# Altium schematic sheet interface.SchDoc: USB Interface (part 1 of 3)
size A4; Author: Peilin Perry Xu; CompanyName: N/A; DrawnBy: Peilin Perry Xu; Engineer: Peilin Perry Xu; Organization: N/A; Address1: 89 Chestnut Street, Toronto, ON, Canada; Address2: 79 Brass Drive, Richmond Hill, ON, Canada; DocumentNumber: 3; Revision: 2; SheetNumber: 6; SheetTotal: 11
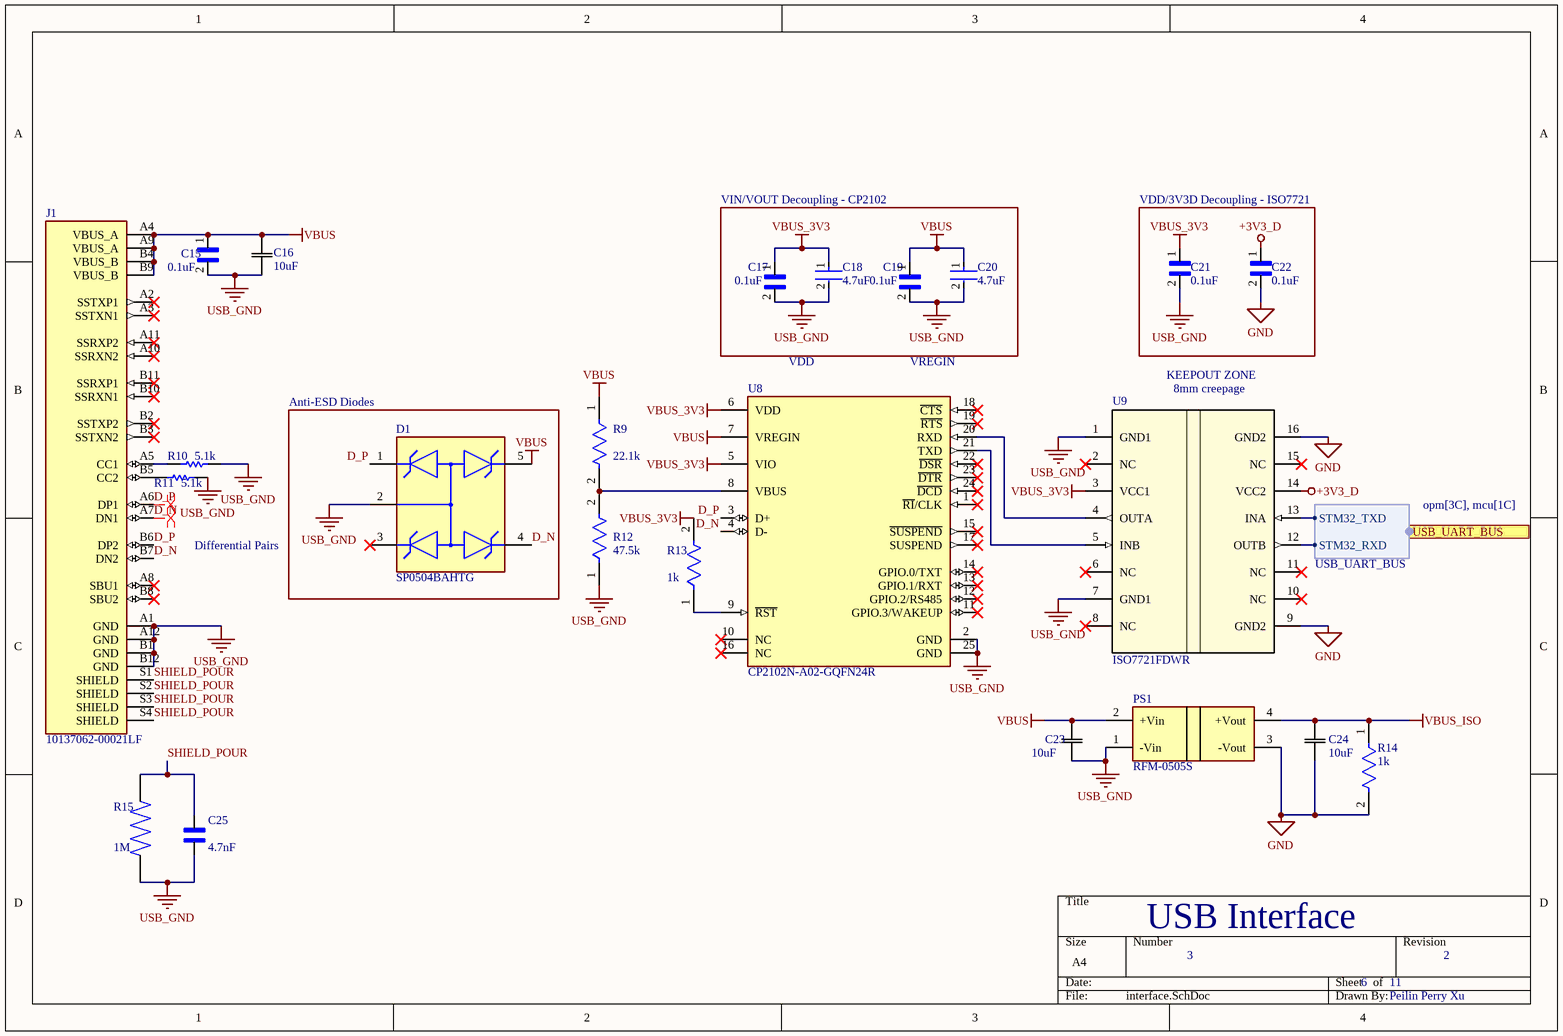
[diagram p0: interface.SchDoc]

## Parts
C15  0.1uF  [CC0603JRX7R8BB104]
C16  10uF  [CC0805KKX7R7BB106]
C17  0.1uF  [CC0603JRX7R8BB104]
C18  4.7uF  [CC0805KKX7R7BB106]
C19  0.1uF  [CC0603JRX7R8BB104]
C20  4.7uF  [CC0805KKX7R7BB106]
C21  0.1uF  [CC0603JRX7R8BB104]
C22  0.1uF  [CC0603JRX7R8BB104]
C23  10uF  [CC0805KKX7R7BB106]
C24  10uF  [CC0805KKX7R7BB106]
C25  4.7nF  [CAPC3216X170N]
D1  SP0504BAHTG  [SP0504BAHTG]
J1  10137062-00021LF  [AMPHENOL_10137062-00021LF]
PS1  RFM-0505S  [RFM-0505S]
R9  22.1k  [RC0603FR-07]
R10  5.1k  [RC0603FR-07]
R11  5.1k  [RC0603FR-07]
R12  47.5k  [RC0603FR-07]
R13  1k  [RC0603FR-07]
R14  1k  [RC0603FR-07]
R15  1M  [RESC2012X50N]
U8  CP2102N-A02-GQFN24R  [CP2102N-A02-GQFN24R]
U9  ISO7721FDWR  [ISO7721FDWR]

## Blocks framed on the sheet
VIN/VOUT Decoupling - CP2102: C17-C20
VDD/3V3D Decoupling - ISO7721: C21 C22
Anti-ESD Diodes: D1

## Ports
USB_UART_BUS (harness USB_UART_BUS, see opm[3C], mcu[1C])

## Harnesses
USB_UART_BUS: STM32_TXD, STM32_RXD

## Nets
+3V3_D: C22.1 U9.14(VCC2)
GND: C22.2 C24.1 PS1.3(-Vout) R14.2 U9.9(GND2) U9.16(GND2)
USB_GND: C15.2 C16.1 C17.2 C18.2 C19.2 C20.2 C21.2 C23.1 C25.1 D1.2 J1.A1(GND) J1.A12(GND) J1.B1(GND) J1.B12(GND) PS1.1(-Vin) R10.2 R11.2 R12.1 R15.1 U8.2(GND) U8.25(GND) U9.1(GND1) U9.7(GND1)
VBUS: C15.1 C16.2 C19.1 C20.1 C23.2 D1.5 J1.A4(VBUS_A) J1.A9(VBUS_A) J1.B4(VBUS_B) J1.B9(VBUS_B) PS1.2(+Vin) R9.1 U8.7(VREGIN)
VBUS_3V3: C17.1 C18.1 C21.1 R13.2 U8.5(VIO) U8.6(VDD) U9.3(VCC1)
VBUS_ISO: C24.2 PS1.4(+Vout) R14.1
D_N: D1.4 J1.A7(DN1) J1.B7(DN2) U8.4(D-)
D_P: D1.1 J1.A6(DP1) J1.B6(DP2) U8.3(D+)
SHIELD_POUR: C25.2 J1.S1(SHIELD) J1.S2(SHIELD) J1.S3(SHIELD) J1.S4(SHIELD) R15.2
NetJ1_A5: J1.A5(CC1) R10.1
NetJ1_B5: J1.B5(CC2) R11.1
NetR9_2: R9.2 R12.2 U8.8(VBUS)
NetR13_1: R13.1 U8.9(~{RST})
NetU8_20: U8.20(RXD) U9.4(OUTA)
NetU8_21: U8.21(TXD) U9.5(INB)
NetU9_12: U9.12(OUTB) ; port USB_UART_BUS.STM32_RXD
NetU9_13: U9.13(INA) ; port USB_UART_BUS.STM32_TXD

Not connected (* = marked no-connect by the designer): D1 3*; J1 A2(SSTXP1)* A3(SSTXN1)* A8(SBU1)* A10(SSRXN2)* A11(SSRXP2)* B2(SSTXP2)* B3(SSTXN2)* B8(SBU2)* B10(SSRXN1)* B11(SSRXP1)*; U8 1(~{RI}/CLK)* 10(NC)* 11(GPIO.3/WAKEUP)* 12(GPIO.2/RS485)* 13(GPIO.1/RXT)* 14(GPIO.0/TXT)* 15(~{SUSPEND})* 16(NC)* 17(SUSPEND)* 18(~{CTS})* 19(~{RTS})* 22(~{DSR})* 23(~{DTR})* 24(~{DCD})*; U9 2(NC)* 6(NC)* 8(NC)* 10(NC)* 11(NC)* 15(NC)*

## Layout directives
differential pair: D_N, D_P

## Notes on the sheet
- (near U8) VDD
- (near U8) VREGIN
- KEEPOUT ZONE
- (near U9) 8mm creepage
- Differential Pairs